# EAGLE schematic AmpSimple-real (EAGLE 7.2.0)
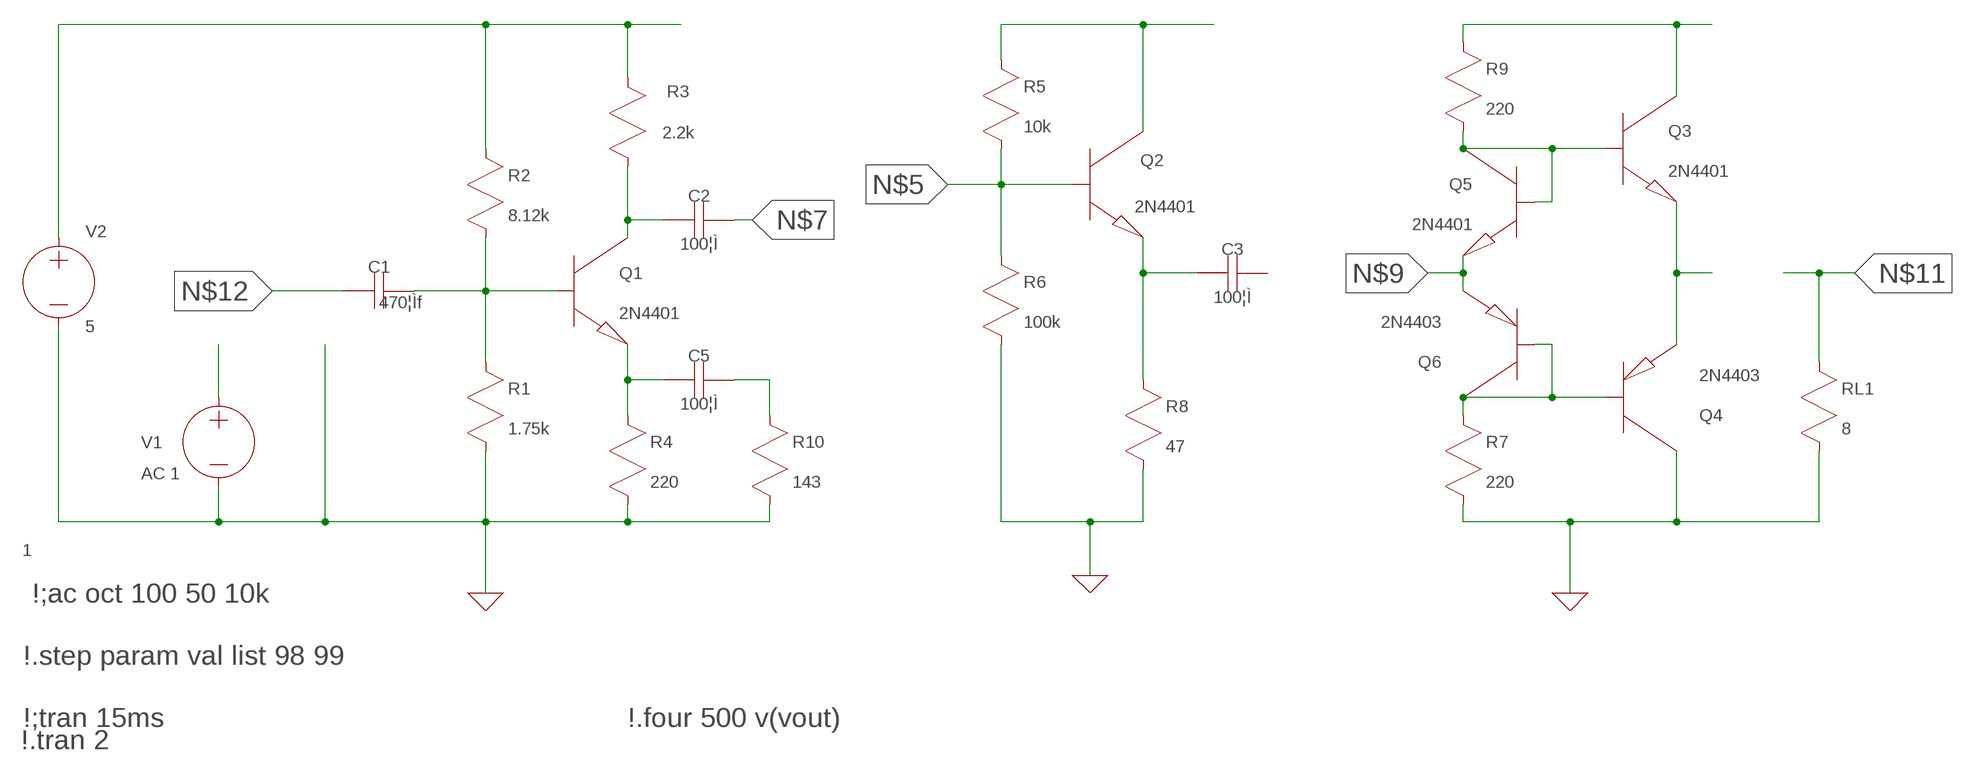
[diagram p0: schematic, sheet 1]

## Parts
C1  470¦Ìf  CAP  [C0805]
C2  100¦Ì  CAP  [C0805]
C3  100¦Ì  CAP  [C0805]
C5  100¦Ì  CAP  [C0805]
Q1  2N4401  NPN  [SOT23]
Q2  2N4401  NPN  [SOT23]
Q3  2N4401  NPN  [SOT23]
Q4  2N4403  PNP  [SOT23]
Q5  2N4401  NPN  [SOT23]
Q6  2N4403  PNP  [SOT23]
R1  1.75k  RES  [R0805]
R2  8.12k  RES  [R0805]
R3  2.2k  RES  [R0805]
R4  220  RES  [R0805]
R5  10k  RES  [R0805]
R6  100k  RES  [R0805]
R7  220  RES  [R0805]
R8  47  RES  [R0805]
R9  220  RES  [R0805]
R10  143  RES  [R0805]
RL1  8  RES  [R0805]
V1  1  VOLTAGE  (no package)
V2  5  VOLTAGE  (no package)

## Nets
0: Q4.3(C) R1.2(B) R4.2(B) R6.2(B) R7.2(B) R8.2(B) R10.2(B) RL1.2(B) V1.- V2.-
N$1: R2.1(A) R3.1(A) V2.+
N$2: Q2.3(C) R5.1(A)
N$3: Q3.3(C) R9.1(A)
N$4: Q3.2(B) Q5.2(B) Q5.3(C) R9.2(B)
N$5: Q2.2(B) R5.2(B) R6.1(A)
N$6: C2.2(B) Q1.3(C) R3.2(B)
N$7: C2.1(A)
N$8: C3.2(B) Q2.1(E) R8.1(A)
N$9: Q5.1(E) Q6.1(E)
N$10: Q3.1(E) Q4.1(E)
N$11: RL1.1(A)
N$12: C1.2(B)
N$13: C1.1(A) Q1.2(B) R1.1(A) R2.2(B)
N$14: Q4.2(B) Q6.2(B) Q6.3(C) R7.1(A)
N$15: C5.2(B) Q1.1(E) R4.1(A)
N$16: C5.1(A) R10.1(A)
N$17: V1.+
Unconnected: C3.1(A)

## Notes on the sheet
- \!;ac oct 100 50 10k
- \!.step param val list 98 99
- \!;tran 15ms | \!.four 500 v(vout)
- \!.tran 2

## Library data of the parts
C1-C3 C5 = sym:CAP: Capacitor
Q1-Q3 Q5 = sym:NPN: Bipolar NPN transistor
Q4 Q6 = sym:PNP: Bipolar PNP transistor
R1-R10 RL1 = sym:RES: A resistor
V1 = lt-spice-simulation:VOLTAGE: Voltage Source, either DC, AC, PULSE, SINE, PWL, EXP, or SFFM; VALUE2: AC 1
V2 = lt-spice-simulation:VOLTAGE: Voltage Source, either DC, AC, PULSE, SINE, PWL, EXP, or SFFM